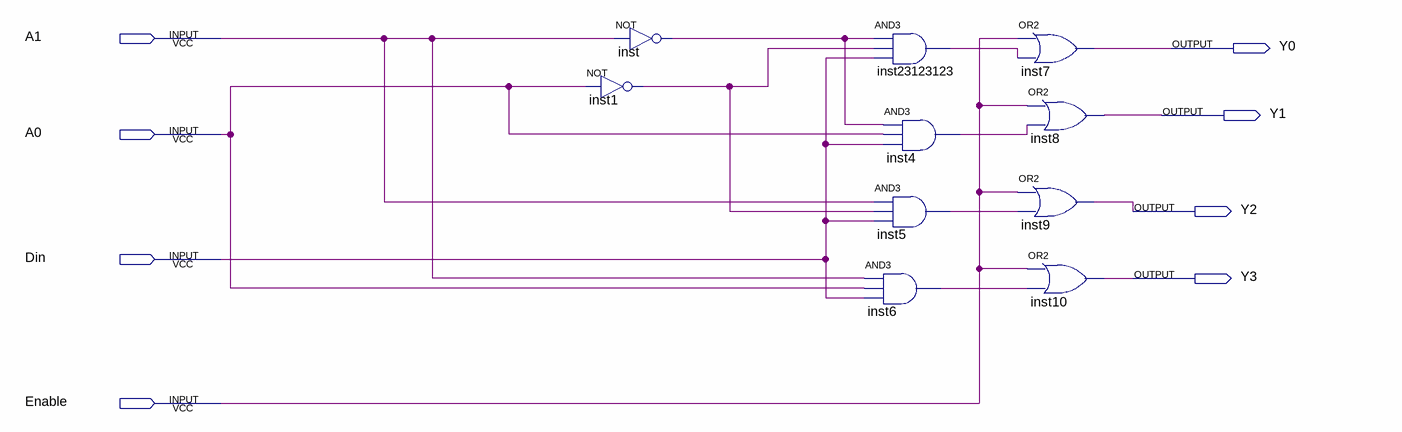
[diagram p0: schematic sheet]
// Quartus schematic distributor.bdf as structural Verilog: 10 symbols, 8 pins
module distributor (
  input  A1,
  input  A0,
  input  Din,
  input  Enable,
  output Y0,
  output Y1,
  output Y2,
  output Y3
);

  wire inst1_out, inst4_out, inst5_out, inst6_out, inst23123123_out, inst_out;

  not inst (inst_out, A1);
  not inst1 (inst1_out, A0);
  and inst23123123 (inst23123123_out, inst_out, inst1_out, Din);
  and inst4 (inst4_out, inst_out, A0, Din);
  and inst5 (inst5_out, A1, inst1_out, Din);
  and inst6 (inst6_out, A1, A0, Din);
  or inst7 (Y0, Enable, inst23123123_out);
  or inst8 (Y1, Enable, inst4_out);
  or inst9 (Y2, Enable, inst5_out);
  or inst10 (Y3, Enable, inst6_out);
endmodule
